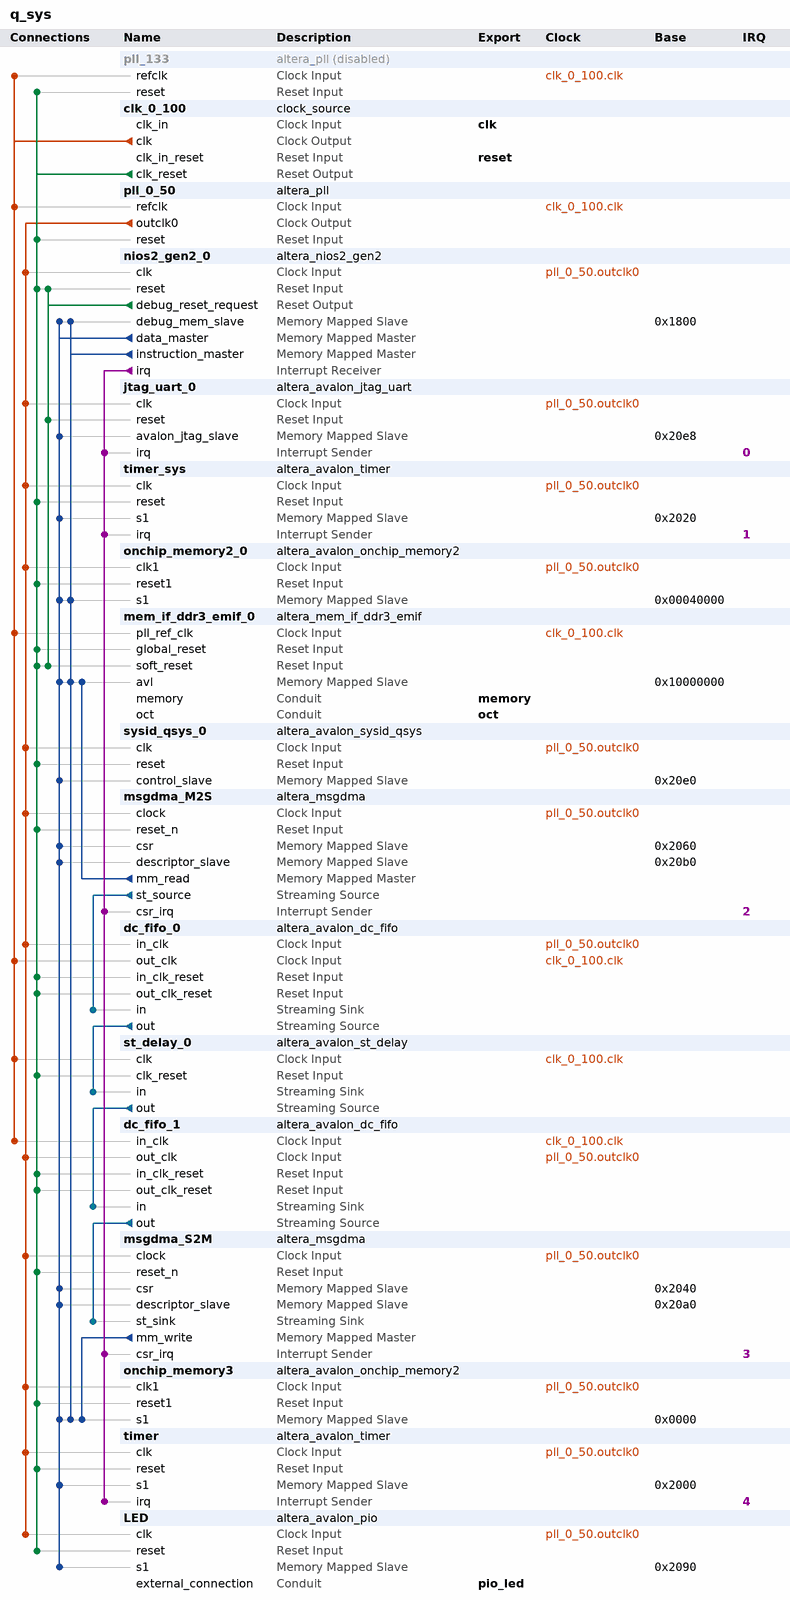
[diagram p0: system contents]
# Platform Designer (Qsys) system q_sys, Arria V 5AGXFB3H4F35C4
# Parameters at their usual value, and those the tool derives, are not listed.
package require -exact qsys 18.1
create_system q_sys
set_project_property DEVICE_FAMILY {Arria V}
set_project_property DEVICE 5AGXFB3H4F35C4

add_instance pll_133 altera_pll 18.1
set_instance_property pll_133 ENABLED false
set_instance_parameter_value pll_133 gui_device_speed_grade 1
set_instance_parameter_value pll_133 gui_number_of_clocks 1
set_instance_parameter_value pll_133 gui_operation_mode direct
set_instance_parameter_value pll_133 gui_output_clock_frequency0 133.0
set_instance_parameter_value pll_133 gui_pll_mode {Integer-N PLL}
set_instance_parameter_value pll_133 gui_reference_clock_frequency 100.0
set_instance_parameter_value pll_133 gui_use_locked true

add_instance clk_0_100 clock_source 18.1
set_instance_parameter_value clk_0_100 clockFrequency 100000000

add_instance pll_0_50 altera_pll 18.1
set_instance_parameter_value pll_0_50 gui_device_speed_grade 2
set_instance_parameter_value pll_0_50 gui_fractional_cout 24
set_instance_parameter_value pll_0_50 gui_number_of_clocks 1
set_instance_parameter_value pll_0_50 gui_operation_mode direct
set_instance_parameter_value pll_0_50 gui_output_clock_frequency0 80.0
set_instance_parameter_value pll_0_50 gui_pll_mode {Fractional-N PLL}
set_instance_parameter_value pll_0_50 gui_reference_clock_frequency 100.0
set_instance_parameter_value pll_0_50 gui_use_locked false

add_instance nios2_gen2_0 altera_nios2_gen2 18.1
set_instance_parameter_value nios2_gen2_0 dcache_size 2048
set_instance_parameter_value nios2_gen2_0 exceptionSlave onchip_memory2_0.s1
set_instance_parameter_value nios2_gen2_0 icache_size 4096
set_instance_parameter_value nios2_gen2_0 impl Tiny
set_instance_parameter_value nios2_gen2_0 resetSlave onchip_memory2_0.s1

add_instance jtag_uart_0 altera_avalon_jtag_uart 18.1
set_instance_parameter_value jtag_uart_0 simInteractiveOptions NO_INTERACTIVE_WINDOWS

add_instance timer_sys altera_avalon_timer 18.1
set_instance_parameter_value timer_sys period 1
set_instance_parameter_value timer_sys periodUnits MSEC

add_instance onchip_memory2_0 altera_avalon_onchip_memory2 18.1
set_instance_parameter_value onchip_memory2_0 allowInSystemMemoryContentEditor true
set_instance_parameter_value onchip_memory2_0 dataWidth 32
set_instance_parameter_value onchip_memory2_0 dualPort false
set_instance_parameter_value onchip_memory2_0 initMemContent false
set_instance_parameter_value onchip_memory2_0 initializationFileName onchip_mem.hex
set_instance_parameter_value onchip_memory2_0 instanceID CPU1
set_instance_parameter_value onchip_memory2_0 memorySize 4096
set_instance_parameter_value onchip_memory2_0 slave1Latency 2

add_instance mem_if_ddr3_emif_0 altera_mem_if_ddr3_emif 18.1
set_instance_parameter_value mem_if_ddr3_emif_0 AVL_DATA_WIDTH_PORT 128,32,32,32,32,32
set_instance_parameter_value mem_if_ddr3_emif_0 AVL_MAX_SIZE 64
set_instance_parameter_value mem_if_ddr3_emif_0 CALIBRATION_MODE Skip
set_instance_parameter_value mem_if_ddr3_emif_0 CPORT_TYPE_PORT Bidirectional,Bidirectional,Bidirectional,Bidirectional,Bidirectional,Bidirectional
set_instance_parameter_value mem_if_ddr3_emif_0 EXPORT_AFI_HALF_CLK false
set_instance_parameter_value mem_if_ddr3_emif_0 HARD_EMIF false
set_instance_parameter_value mem_if_ddr3_emif_0 MEM_BANKADDR_WIDTH 3
set_instance_parameter_value mem_if_ddr3_emif_0 MEM_CLK_FREQ 400.0
set_instance_parameter_value mem_if_ddr3_emif_0 MEM_CLK_FREQ_MAX 400.0
set_instance_parameter_value mem_if_ddr3_emif_0 MEM_COL_ADDR_WIDTH 10
set_instance_parameter_value mem_if_ddr3_emif_0 MEM_DQ_WIDTH 32
set_instance_parameter_value mem_if_ddr3_emif_0 MEM_DRV_STR RZQ/6
set_instance_parameter_value mem_if_ddr3_emif_0 MEM_FORMAT DISCRETE
set_instance_parameter_value mem_if_ddr3_emif_0 MEM_ROW_ADDR_WIDTH 13
set_instance_parameter_value mem_if_ddr3_emif_0 MEM_RTT_NOM RZQ/4
set_instance_parameter_value mem_if_ddr3_emif_0 MEM_TCL 9
set_instance_parameter_value mem_if_ddr3_emif_0 MEM_TFAW_NS 45.0
set_instance_parameter_value mem_if_ddr3_emif_0 MEM_TRAS_NS 36.0
set_instance_parameter_value mem_if_ddr3_emif_0 MEM_TRCD_NS 13.5
set_instance_parameter_value mem_if_ddr3_emif_0 MEM_TRFC_NS 110.0
set_instance_parameter_value mem_if_ddr3_emif_0 MEM_TRP_NS 13.5
set_instance_parameter_value mem_if_ddr3_emif_0 MEM_TRRD_NS 7.5
set_instance_parameter_value mem_if_ddr3_emif_0 MEM_TRTP_NS 7.5
set_instance_parameter_value mem_if_ddr3_emif_0 MEM_TWTR 5
set_instance_parameter_value mem_if_ddr3_emif_0 MEM_VENDOR Micron
set_instance_parameter_value mem_if_ddr3_emif_0 MEM_WTCL 7
set_instance_parameter_value mem_if_ddr3_emif_0 PLL_LOCATION Top_Bottom
set_instance_parameter_value mem_if_ddr3_emif_0 POWER_OF_TWO_BUS true
set_instance_parameter_value mem_if_ddr3_emif_0 PRIORITY_PORT 1,1,1,1,1,1
set_instance_parameter_value mem_if_ddr3_emif_0 RATE Quarter
set_instance_parameter_value mem_if_ddr3_emif_0 REF_CLK_FREQ 100.0
set_instance_parameter_value mem_if_ddr3_emif_0 SPEED_GRADE 4
set_instance_parameter_value mem_if_ddr3_emif_0 TIMING_BOARD_AC_SKEW 0.0039
set_instance_parameter_value mem_if_ddr3_emif_0 TIMING_BOARD_AC_TO_CK_SKEW -0.001
set_instance_parameter_value mem_if_ddr3_emif_0 TIMING_BOARD_DERATE_METHOD SLEW_RATE
set_instance_parameter_value mem_if_ddr3_emif_0 TIMING_BOARD_DQ_TO_DQS_SKEW -0.004
set_instance_parameter_value mem_if_ddr3_emif_0 TIMING_BOARD_MAX_CK_DELAY 0.42
set_instance_parameter_value mem_if_ddr3_emif_0 TIMING_BOARD_MAX_DQS_DELAY 0.437
set_instance_parameter_value mem_if_ddr3_emif_0 TIMING_BOARD_SKEW_BETWEEN_DQS 0.029
set_instance_parameter_value mem_if_ddr3_emif_0 TIMING_BOARD_SKEW_CKDQS_DIMM_MAX 0.012
set_instance_parameter_value mem_if_ddr3_emif_0 TIMING_BOARD_SKEW_CKDQS_DIMM_MIN -0.0039
set_instance_parameter_value mem_if_ddr3_emif_0 TIMING_BOARD_SKEW_WITHIN_DQS 0.011
set_instance_parameter_value mem_if_ddr3_emif_0 TIMING_TDH 65
set_instance_parameter_value mem_if_ddr3_emif_0 TIMING_TDQSCK 255
set_instance_parameter_value mem_if_ddr3_emif_0 TIMING_TDQSQ 125
set_instance_parameter_value mem_if_ddr3_emif_0 TIMING_TDQSS 0.25
set_instance_parameter_value mem_if_ddr3_emif_0 TIMING_TDS 30
set_instance_parameter_value mem_if_ddr3_emif_0 TIMING_TDSH 0.2
set_instance_parameter_value mem_if_ddr3_emif_0 TIMING_TDSS 0.2
set_instance_parameter_value mem_if_ddr3_emif_0 TIMING_TIH 140
set_instance_parameter_value mem_if_ddr3_emif_0 TIMING_TIS 190
set_instance_parameter_value mem_if_ddr3_emif_0 TIMING_TQSH 0.4
set_instance_parameter_value mem_if_ddr3_emif_0 USER_DEBUG_LEVEL 1

add_instance sysid_qsys_0 altera_avalon_sysid_qsys 18.1
set_instance_parameter_value sysid_qsys_0 id 1

add_instance msgdma_M2S altera_msgdma 18.1
set_instance_parameter_value msgdma_M2S BURST_ENABLE 0
set_instance_parameter_value msgdma_M2S DATA_FIFO_DEPTH 16
set_instance_parameter_value msgdma_M2S DATA_WIDTH 32
set_instance_parameter_value msgdma_M2S DESCRIPTOR_FIFO_DEPTH 128
set_instance_parameter_value msgdma_M2S ENHANCED_FEATURES 0
set_instance_parameter_value msgdma_M2S ERROR_ENABLE 0
set_instance_parameter_value msgdma_M2S MAX_BURST_COUNT 2
set_instance_parameter_value msgdma_M2S MAX_BYTE 1024
set_instance_parameter_value msgdma_M2S MODE 1
set_instance_parameter_value msgdma_M2S PACKET_ENABLE 0
set_instance_parameter_value msgdma_M2S TRANSFER_TYPE {Full Word Accesses Only}
set_instance_parameter_value msgdma_M2S USE_FIX_ADDRESS_WIDTH 1

add_instance dc_fifo_0 altera_avalon_dc_fifo 18.1
set_instance_parameter_value dc_fifo_0 BITS_PER_SYMBOL 8
set_instance_parameter_value dc_fifo_0 FIFO_DEPTH 16
set_instance_parameter_value dc_fifo_0 SYMBOLS_PER_BEAT 4
set_instance_parameter_value dc_fifo_0 USE_PACKETS 0

add_instance st_delay_0 altera_avalon_st_delay 18.1
set_instance_parameter_value st_delay_0 BITS_PER_SYMBOL 8
set_instance_parameter_value st_delay_0 CHANNEL_WIDTH 1
set_instance_parameter_value st_delay_0 DATA_WIDTH 32
set_instance_parameter_value st_delay_0 ERROR_WIDTH 1
set_instance_parameter_value st_delay_0 MAX_CHANNELS 1
set_instance_parameter_value st_delay_0 NUMBER_OF_DELAY_CLOCKS 8
set_instance_parameter_value st_delay_0 USE_CHANNEL 0
set_instance_parameter_value st_delay_0 USE_ERROR 0
set_instance_parameter_value st_delay_0 USE_PACKETS 0

add_instance dc_fifo_1 altera_avalon_dc_fifo 18.1
set_instance_parameter_value dc_fifo_1 BITS_PER_SYMBOL 8
set_instance_parameter_value dc_fifo_1 FIFO_DEPTH 16
set_instance_parameter_value dc_fifo_1 SYMBOLS_PER_BEAT 4
set_instance_parameter_value dc_fifo_1 USE_PACKETS 0

add_instance msgdma_S2M altera_msgdma 18.1
set_instance_parameter_value msgdma_S2M BURST_ENABLE 0
set_instance_parameter_value msgdma_S2M DATA_FIFO_DEPTH 32
set_instance_parameter_value msgdma_S2M DATA_WIDTH 32
set_instance_parameter_value msgdma_S2M DESCRIPTOR_FIFO_DEPTH 128
set_instance_parameter_value msgdma_S2M ENHANCED_FEATURES 0
set_instance_parameter_value msgdma_S2M ERROR_ENABLE 0
set_instance_parameter_value msgdma_S2M MAX_BURST_COUNT 2
set_instance_parameter_value msgdma_S2M MAX_BYTE 1024
set_instance_parameter_value msgdma_S2M MODE 2
set_instance_parameter_value msgdma_S2M PACKET_ENABLE 0
set_instance_parameter_value msgdma_S2M TRANSFER_TYPE {Full Word Accesses Only}
set_instance_parameter_value msgdma_S2M USE_FIX_ADDRESS_WIDTH 1

add_instance onchip_memory3 altera_avalon_onchip_memory2 18.1
set_instance_parameter_value onchip_memory3 dataWidth 64
set_instance_parameter_value onchip_memory3 dualPort false
set_instance_parameter_value onchip_memory3 initMemContent false
set_instance_parameter_value onchip_memory3 initializationFileName onchip_mem.hex
set_instance_parameter_value onchip_memory3 memorySize 4096
set_instance_parameter_value onchip_memory3 slave1Latency 2

add_instance timer altera_avalon_timer 18.1
set_instance_parameter_value timer alwaysRun true
set_instance_parameter_value timer fixedPeriod true
set_instance_parameter_value timer period 1
set_instance_parameter_value timer periodUnits MSEC
set_instance_parameter_value timer snapshot false

add_instance LED altera_avalon_pio 18.1
set_instance_parameter_value LED direction Output
set_instance_parameter_value LED width 8

# connections
add_connection clk_0_100.clk dc_fifo_0.out_clk clock
add_connection clk_0_100.clk dc_fifo_1.in_clk clock
add_connection clk_0_100.clk mem_if_ddr3_emif_0.pll_ref_clk clock
add_connection clk_0_100.clk pll_0_50.refclk clock
add_connection clk_0_100.clk pll_133.refclk clock
add_connection clk_0_100.clk st_delay_0.clk clock
add_connection pll_0_50.outclk0 dc_fifo_0.in_clk clock
add_connection pll_0_50.outclk0 dc_fifo_1.out_clk clock
add_connection pll_0_50.outclk0 jtag_uart_0.clk clock
add_connection pll_0_50.outclk0 LED.clk clock
add_connection pll_0_50.outclk0 msgdma_M2S.clock clock
add_connection pll_0_50.outclk0 msgdma_S2M.clock clock
add_connection pll_0_50.outclk0 nios2_gen2_0.clk clock
add_connection pll_0_50.outclk0 onchip_memory2_0.clk1 clock
add_connection pll_0_50.outclk0 onchip_memory3.clk1 clock
add_connection pll_0_50.outclk0 sysid_qsys_0.clk clock
add_connection pll_0_50.outclk0 timer.clk clock
add_connection pll_0_50.outclk0 timer_sys.clk clock
add_connection clk_0_100.clk_reset dc_fifo_0.in_clk_reset reset
add_connection clk_0_100.clk_reset dc_fifo_0.out_clk_reset reset
add_connection clk_0_100.clk_reset dc_fifo_1.in_clk_reset reset
add_connection clk_0_100.clk_reset dc_fifo_1.out_clk_reset reset
add_connection clk_0_100.clk_reset LED.reset reset
add_connection clk_0_100.clk_reset mem_if_ddr3_emif_0.global_reset reset
add_connection clk_0_100.clk_reset mem_if_ddr3_emif_0.soft_reset reset
add_connection clk_0_100.clk_reset msgdma_M2S.reset_n reset
add_connection clk_0_100.clk_reset msgdma_S2M.reset_n reset
add_connection clk_0_100.clk_reset nios2_gen2_0.reset reset
add_connection clk_0_100.clk_reset onchip_memory2_0.reset1 reset
add_connection clk_0_100.clk_reset onchip_memory3.reset1 reset
add_connection clk_0_100.clk_reset pll_0_50.reset reset
add_connection clk_0_100.clk_reset pll_133.reset reset
add_connection clk_0_100.clk_reset st_delay_0.clk_reset reset
add_connection clk_0_100.clk_reset sysid_qsys_0.reset reset
add_connection clk_0_100.clk_reset timer.reset reset
add_connection clk_0_100.clk_reset timer_sys.reset reset
add_connection nios2_gen2_0.debug_reset_request jtag_uart_0.reset reset
add_connection nios2_gen2_0.debug_reset_request mem_if_ddr3_emif_0.soft_reset reset
add_connection nios2_gen2_0.debug_reset_request nios2_gen2_0.reset reset
add_connection msgdma_M2S.mm_read mem_if_ddr3_emif_0.avl avalon
set_connection_parameter_value msgdma_M2S.mm_read/mem_if_ddr3_emif_0.avl baseAddress 0x10000000
add_connection msgdma_S2M.mm_write onchip_memory3.s1 avalon
set_connection_parameter_value msgdma_S2M.mm_write/onchip_memory3.s1 baseAddress 0x0000
add_connection nios2_gen2_0.data_master jtag_uart_0.avalon_jtag_slave avalon
set_connection_parameter_value nios2_gen2_0.data_master/jtag_uart_0.avalon_jtag_slave baseAddress 0x20e8
add_connection nios2_gen2_0.data_master LED.s1 avalon
set_connection_parameter_value nios2_gen2_0.data_master/LED.s1 baseAddress 0x2090
add_connection nios2_gen2_0.data_master mem_if_ddr3_emif_0.avl avalon
set_connection_parameter_value nios2_gen2_0.data_master/mem_if_ddr3_emif_0.avl baseAddress 0x10000000
add_connection nios2_gen2_0.data_master msgdma_M2S.csr avalon
set_connection_parameter_value nios2_gen2_0.data_master/msgdma_M2S.csr baseAddress 0x2060
add_connection nios2_gen2_0.data_master msgdma_M2S.descriptor_slave avalon
set_connection_parameter_value nios2_gen2_0.data_master/msgdma_M2S.descriptor_slave baseAddress 0x20b0
add_connection nios2_gen2_0.data_master msgdma_S2M.csr avalon
set_connection_parameter_value nios2_gen2_0.data_master/msgdma_S2M.csr baseAddress 0x2040
add_connection nios2_gen2_0.data_master msgdma_S2M.descriptor_slave avalon
set_connection_parameter_value nios2_gen2_0.data_master/msgdma_S2M.descriptor_slave baseAddress 0x20a0
add_connection nios2_gen2_0.data_master nios2_gen2_0.debug_mem_slave avalon
set_connection_parameter_value nios2_gen2_0.data_master/nios2_gen2_0.debug_mem_slave baseAddress 0x1800
add_connection nios2_gen2_0.data_master onchip_memory2_0.s1 avalon
set_connection_parameter_value nios2_gen2_0.data_master/onchip_memory2_0.s1 baseAddress 0x00040000
add_connection nios2_gen2_0.data_master onchip_memory3.s1 avalon
set_connection_parameter_value nios2_gen2_0.data_master/onchip_memory3.s1 baseAddress 0x0000
add_connection nios2_gen2_0.data_master sysid_qsys_0.control_slave avalon
set_connection_parameter_value nios2_gen2_0.data_master/sysid_qsys_0.control_slave baseAddress 0x20e0
add_connection nios2_gen2_0.data_master timer.s1 avalon
set_connection_parameter_value nios2_gen2_0.data_master/timer.s1 baseAddress 0x2000
add_connection nios2_gen2_0.data_master timer_sys.s1 avalon
set_connection_parameter_value nios2_gen2_0.data_master/timer_sys.s1 baseAddress 0x2020
add_connection nios2_gen2_0.instruction_master mem_if_ddr3_emif_0.avl avalon
set_connection_parameter_value nios2_gen2_0.instruction_master/mem_if_ddr3_emif_0.avl baseAddress 0x10000000
add_connection nios2_gen2_0.instruction_master nios2_gen2_0.debug_mem_slave avalon
set_connection_parameter_value nios2_gen2_0.instruction_master/nios2_gen2_0.debug_mem_slave baseAddress 0x1800
add_connection nios2_gen2_0.instruction_master onchip_memory2_0.s1 avalon
set_connection_parameter_value nios2_gen2_0.instruction_master/onchip_memory2_0.s1 baseAddress 0x00040000
add_connection nios2_gen2_0.instruction_master onchip_memory3.s1 avalon
set_connection_parameter_value nios2_gen2_0.instruction_master/onchip_memory3.s1 baseAddress 0x0000
add_connection dc_fifo_0.out st_delay_0.in avalon_streaming
add_connection dc_fifo_1.out msgdma_S2M.st_sink avalon_streaming
add_connection msgdma_M2S.st_source dc_fifo_0.in avalon_streaming
add_connection st_delay_0.out dc_fifo_1.in avalon_streaming
add_connection nios2_gen2_0.irq jtag_uart_0.irq interrupt
set_connection_parameter_value nios2_gen2_0.irq/jtag_uart_0.irq irqNumber 0
add_connection nios2_gen2_0.irq msgdma_M2S.csr_irq interrupt
set_connection_parameter_value nios2_gen2_0.irq/msgdma_M2S.csr_irq irqNumber 2
add_connection nios2_gen2_0.irq msgdma_S2M.csr_irq interrupt
set_connection_parameter_value nios2_gen2_0.irq/msgdma_S2M.csr_irq irqNumber 3
add_connection nios2_gen2_0.irq timer.irq interrupt
set_connection_parameter_value nios2_gen2_0.irq/timer.irq irqNumber 4
add_connection nios2_gen2_0.irq timer_sys.irq interrupt
set_connection_parameter_value nios2_gen2_0.irq/timer_sys.irq irqNumber 1

# exported interfaces
add_interface clk clock sink
set_interface_property clk EXPORT_OF clk_0_100.clk_in
add_interface memory conduit end
set_interface_property memory EXPORT_OF mem_if_ddr3_emif_0.memory
add_interface oct conduit end
set_interface_property oct EXPORT_OF mem_if_ddr3_emif_0.oct
add_interface pio_led conduit end
set_interface_property pio_led EXPORT_OF LED.external_connection
add_interface reset reset sink
set_interface_property reset EXPORT_OF clk_0_100.clk_in_reset

set_interconnect_requirement {$system} qsys_mm.clockCrossingAdapter AUTO
set_interconnect_requirement {$system} qsys_mm.maxAdditionalLatency 4

save_system q_sys.qsys
